# EAGLE schematic Lattepanda_shild_v1.2 (EAGLE 6.5.0)
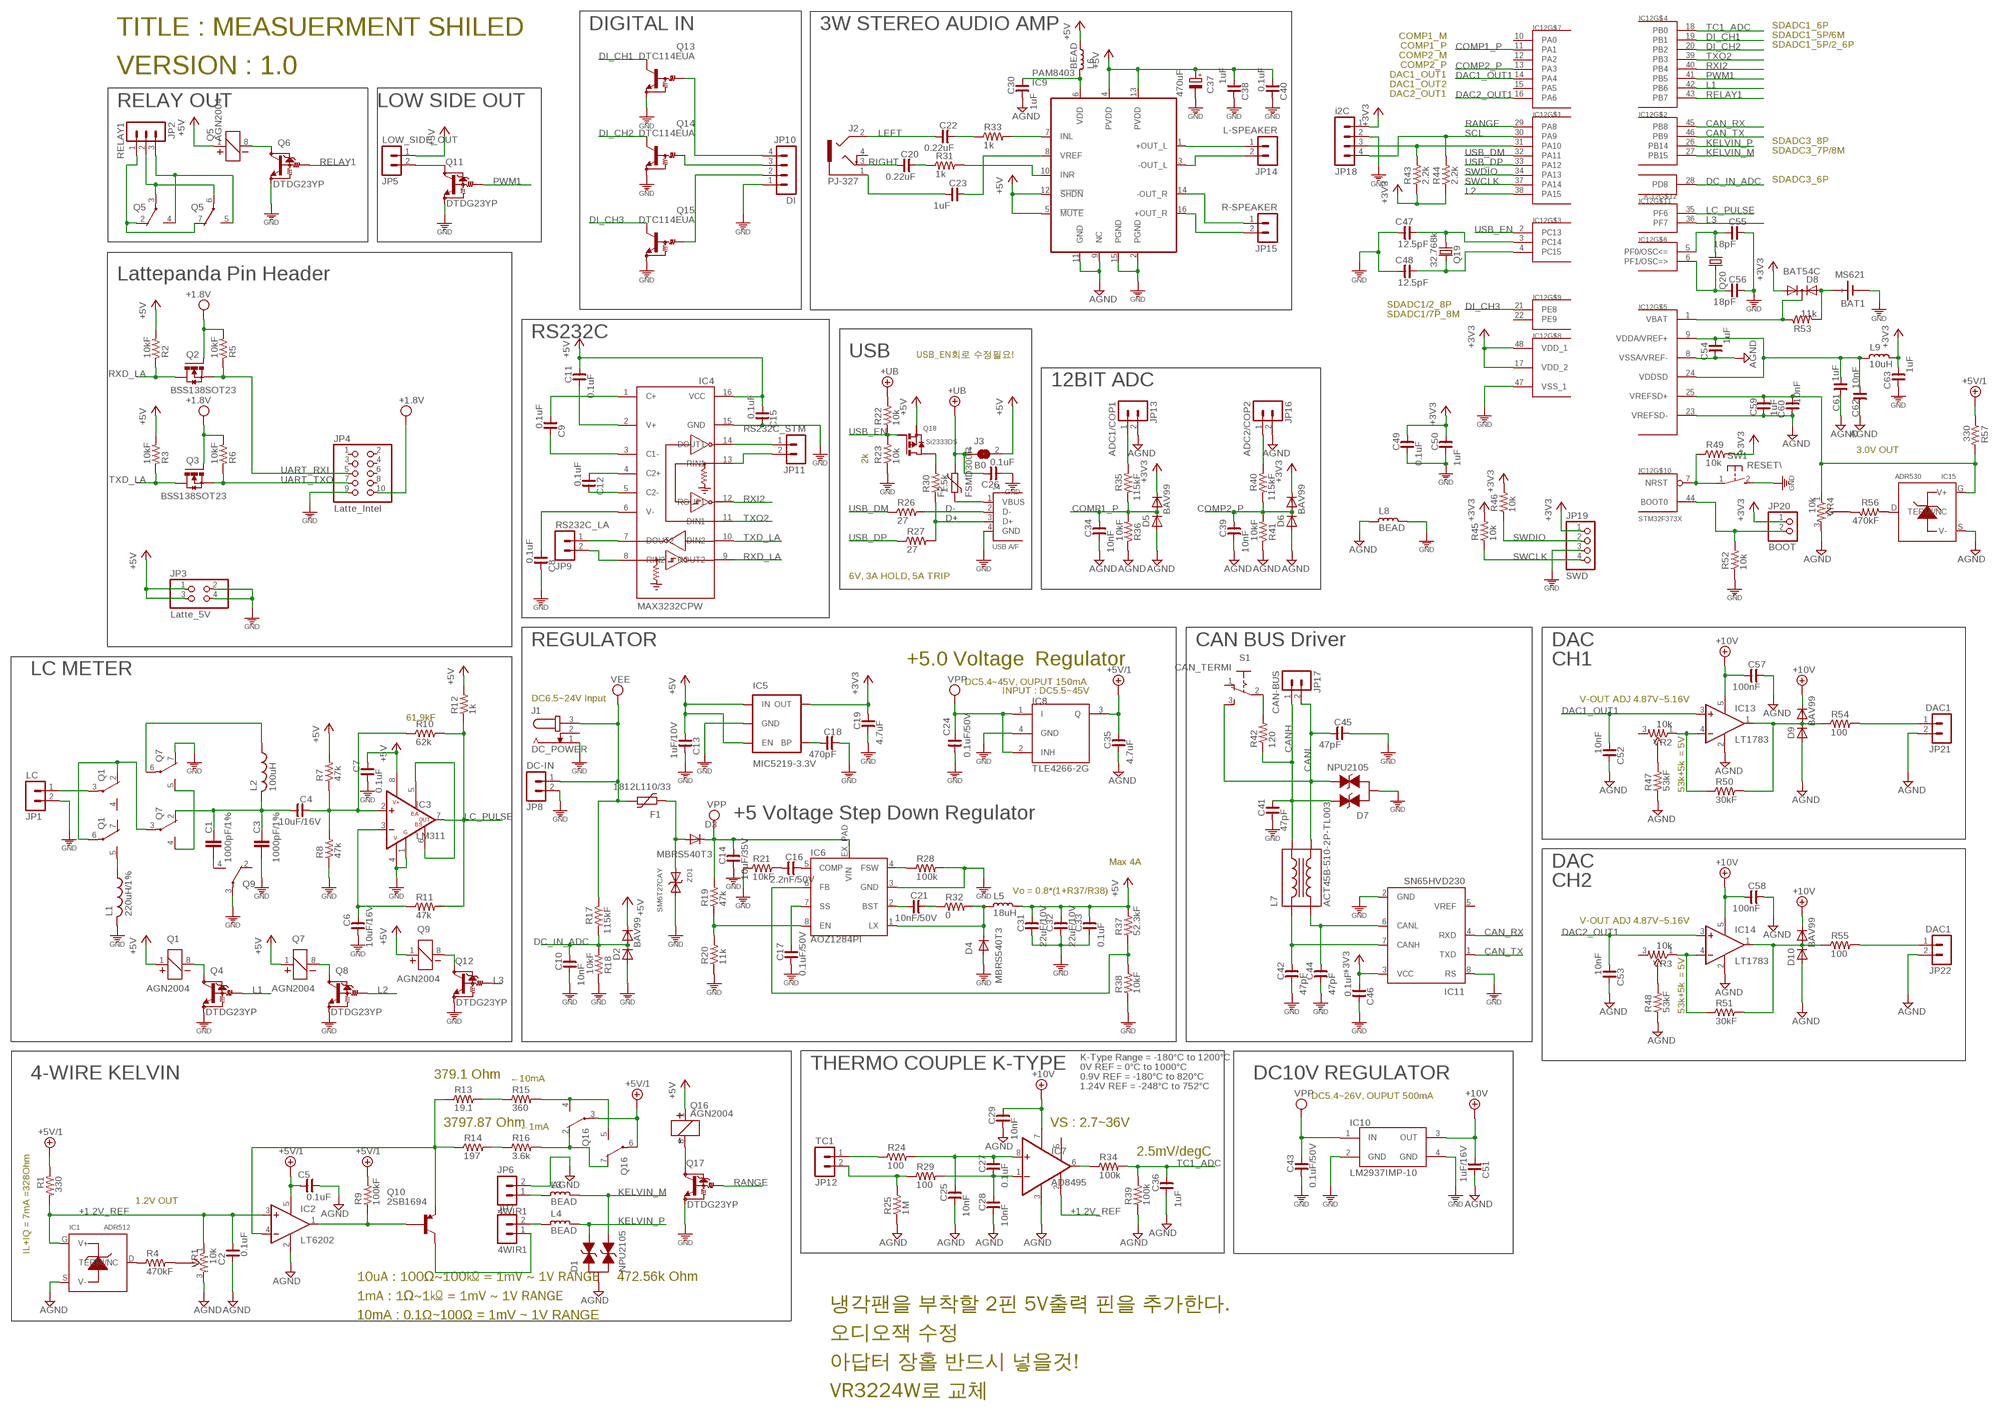
[diagram p0: schematic, sheet 1]

## Parts
BAT1  MS621  MS614  [MS621]
C1  1000pF/1%  C-EU050-025X075  [C050-025X075]
C2  0.1uF  C_0603  [C0603]
C3  1000pF/1%  C-EU050-025X075  [C050-025X075]
C4  10uF/16V  C_3216  [C3216]
C5  0.1uF  C_0603  [C0603]
C6  10uF/16V  C_3216  [C3216]
C7  0.1uF  C_0603  [C0603]
C8  0.1uF  C_0603  [C0603]
C9  0.1uF  C_0603  [C0603]
C10  10nF  C_0603  [C0603]
C11  0.1uF  C_0603  [C0603]
C12  0.1uF  C_0603  [C0603]
C13  1uF/10V  C_0603  [C0603]
C14  10uF/35V  C_3225  [C3225]
C15  0.1uF  C_0603  [C0603]
C16  2.2nF/50V  C_0603  [C0603]
C17  0.1uF/50V  C_0603  [C0603]
C18  470pF  C_0603  [C0603]
C19  4.7uF  C_2012  [C2012]
C20  0.22uF  C_0603  [C0603]
C21  10nF/50V  C_0603  [C0603]
C22  0.22uF  C_0603  [C0603]
C23  1uF  C_0603  [C0603]
C24  0.1uF/50V  C_0603  [C1608-]
C25  10nF  C_0603  [C0603]
C26  0.1uF  C_0603  [C0603]
C27  0.1uF  C_0603  [C0603]
C28  10nF  C_0603  [C0603]
C29  10nF  C_0603  [C0603]
C30  1uF  C_0603  [C0603]
C31  22uF/10V  C_3216  [C3216]
C32  22uF/10V  C_3216  [C3216]
C33  0.1uF  C_0603  [C0603]
C34  10nF  C_0603  [C0603]
C35  4.7uF  C_2012  [C2012]
C36  1uF  C_0603  [C0603]
C37  470uF  CPOL-EUD/7343-31W  [D/7343-31W]
C38  1uF  C_0603  [C0603]
C39  10nF  C_0603  [C0603]
C40  0.1uF  C_0603  [C0603]
C41  47pF  C_0603  [C0603]
C42  47pF  C_0603  [C0603]
C43  0.1uF/50V  C_0603  [C0603]
C44  47pF  C_0603  [C0603]
C45  47pF  C_0603  [C0603]
C46  0.1uF  C_0603  [C0603]
C47  12.5pF  C_0603  [C0603]
C48  12.5pF  C_0603  [C0603]
C49  0.1uF  C_0603  [C0603]
C50  1uF  C_0603  [C0603]
C51  1uF/16V  C_0603  [C0603]
C52  10nF  C_0603  [C0603]
C53  10nF  C_0603  [C0603]
C54  1uF  C_0603  [C0603]
C55  18pF  C_0603  [C0603]
C56  18pF  C_0603  [C0603]
C57  100nF  C_0603  [C0603]
C58  100nF  C_0603  [C0603]
C59  1uF  C_0603  [C0603]
C60  10nF  C_0603  [C0603]
C61  1uF  C_0603  [C0603]
C62  10nF  C_0603  [C0603]
C63  1uF  C_0603  [C0603]
D1  NPU2105  [SOT23]
D2  BAV99  [SOT23]
D3  MBRS540T3  DIODE-SMC  [SMC]
D4  MBRS540T3  DIODE-SMC  [SMC]
D5  BAV99  [SOT23]
D6  BAV99  [SOT23]
D7  NPU2105  [SOT23]
D8  BAT54C  [SOT23]
D9  BAV99  [SOT23]
D10  BAV99  [SOT23]
F1  1812L110/33  1812L  [1812L]
F2  FSMD300R  1812L  [1812L]
IC1  ADR512  ADR510  [SOT23]
IC2  LT6202  TS507S  [SOT23-5L]
IC3  LM311  [SO8]
IC4  MAX3232CPW  MAX3232MAX232CPW  [PW_R-PDSO-G16]
IC5  MIC5219-3.3V  V_REG_LDOSMD  [SOT23-5]
IC6  AOZ1284PI  [S08-EP1]
IC7  AD8495  AD849X  [MSOP8]
IC8  TLE4266-2G  TLE4266G  [SOT223-4]
IC9  PAM8403  [SOIC16N]
IC10  LM2937IMP-10  LM2937  [SOT223]
IC11  SN65HVD230  PCA82C250T  [SO8]
IC12  STM32F373X  [TQFP48]
IC13  LT1783  LT1783M5  [SOT23-5]
IC14  LT1783  LT1783M5  [SOT23-5]
IC15  ADR530  ADR510  [SOT23]
J1  DC_POWER  JACK-PLUG0  [SPC4077]
J2  PJ-327  AUDIO_JACK2  [PJ-327-2]
J3  B0  SJ  [SJ]
J4  USB A/F  USB-AUSBA_SIDE  [USB_AF_SIDE]
JP1  LC  MA02ED350V-02P  [ED350V-02P]
JP2  RELAY1  MA03-1ESD350V-03P  [ED350V-03P]
JP3  Latte_5V  PINHD-2X2  [2X02]
JP4  Latte_Intel  PINHD-2X5M  [2X05M]
JP5  LOW_SIDE_OUT  MA02ED350V-02P  [ED350V-02P]
JP6  4WIR1  MA02ED350V-02P  [ED350V-02P]
JP7  4WIR1  MA02ED350V-02P  [ED350V-02P]
JP8  DC-IN  MA02ED350V-02P  [ED350V-02P]
JP9  RS232C_LA  MA02ED350V-02P  [ED350V-02P]
JP10  DI  MA04-153047  [53047-04]
JP11  RS232C_STM  MA02ED350V-02P  [ED350V-02P]
JP12  TC1  MA02ED350V-02P  [ED350V-02P]
JP13  ADC1/COP1  MA02ED350V-02P  [ED350V-02P]
JP14  L-SPEAKER  MA02ED350V-02P  [ED350V-02P]
JP15  R-SPEAKER  MA02ED350V-02P  [ED350V-02P]
JP16  ADC2/COP2  MA02ED350V-02P  [ED350V-02P]
JP17  CAN-BUS  MA02ED350V-02P  [ED350V-02P]
JP18  i2C  MA04-15267  [MOLEX5267-04]
JP19  SWD  PINHD-1X4M  [1X04M]
JP20  BOOT  PINHD-1X2M  [1X02M]
JP21  DAC1  MA02ED350V-02P  [ED350V-02P]
JP22  DAC1  MA02ED350V-02P  [ED350V-02P]
L1  220uH/1%  L-US0207/2V  [0207/2V]
L2  100uH  L-US0207/2V  [0207/2V]
L3  BEAD  L_0603  [L0603]
L4  BEAD  L_0603  [L0603]
L5  18uH  L_SHP1260P-F  [SHP1260P-F]
L6  BEAD  L_0805  [L0805]
L7  ACT45B-510-2P-TL003  CHOKE_COIL  [ACT45B]
L8  BEAD  L_0603  [L0603]
L9  10uH  L_0805  [L0805]
Q1  AGN2004  RELAY_CH2AGN200X  [ANG200X]
Q2  BSS138SOT23  [SOT23]
Q3  BSS138SOT23  [SOT23]
Q4  DTDG23YP  [MPT3]
Q5  AGN2004  RELAY_CH2AGN200X  [ANG200X]
Q6  DTDG23YP  [MPT3]
Q7  AGN2004  RELAY_CH2AGN200X  [ANG200X]
Q8  DTDG23YP  [MPT3]
Q9  AGN2004  RELAY_CH2AGN200X  [ANG200X]
Q10  2SB1694  [SOT323]
Q11  DTDG23YP  [MPT3]
Q12  DTDG23YP  [MPT3]
Q13  DTC114EUA  [SC59-BEC]
Q14  DTC114EUA  [SC59-BEC]
Q15  DTC114EUA  [SC59-BEC]
Q16  AGN2004  RELAY_CH2AGN200X  [ANG200X]
Q17  DTDG23YP  [MPT3]
Q18  Si2333DS  P-FET  [SOT23]
Q19  32.768k  MC-306  [MC-306]
Q20  8MHz  CRYSTALSMD5032  [SMD5032]
R1  330  R_0603  [R0603]
R2  10kF  R_0603  [R0603]
R3  10kF  R_0603  [R0603]
R4  470kF  R_0603  [R0603]
R5  10kF  R_0603  [R0603]
R6  10kF  R_0603  [R0603]
R7  47k  R_0603  [R0603]
R8  47k  R_0603  [R0603]
R9  100kF  R_0603  [R0603]
R10  62k  R_0603  [R0603]
R11  47k  R_0603  [R0603]
R12  1k  R_0603  [R0603]
R13  19.1  R_0603  [R0603]
R14  197  R_0603  [R0603]
R15  360  R_0603  [R0603]
R16  3.6k  R_0603  [R0603]
R17  115kF  R_0603  [R0603]
R18  10kF  R_0603  [R0603]
R19  47k  R_0603  [R0603]
R20  11k  R_0603  [R0603]
R21  10kF  R_0603  [R0603]
R22  10k  R_0603  [R0603]
R23  10k  R_0603  [R0603]
R24  100  R_0603  [R0603]
R25  1M  R_0603  [R0603]
R26  27  R_0603  [R0603]
R27  27  R_0603  [R0603]
R28  100k  R_0603  [R0603]
R29  100  R_0603  [R0603]
R30  1.5k  R_0603  [R0603]
R31  1k  R_0603  [R0603]
R32  0  R_0603  [R0603]
R33  1k  R_0603  [R0603]
R34  100k  R_0603  [R0603]
R35  115kF  R_0603  [R0603]
R36  10kF  R_0603  [R0603]
R37  52.3kF  R_0603  [R0603]
R38  10kF  R_0603  [R0603]
R39  100k  R_0603  [R0603]
R40  115kF  R_0603  [R0603]
R41  10kF  R_0603  [R0603]
R42  120  R-US_R1608  [R0603@1]
R43  2.2k  R_0603  [R0603]
R44  2.2k  R_0603  [R0603]
R45  10k  R_0603  [R0603]
R46  10k  R_0603  [R0603]
R47  53kF  R_0603  [R0603]
R48  53kF  R_0603  [R0603]
R49  10k  R_0603  [R0603]
R50  30kF  R_0603  [R0603]
R51  30kF  R_0603  [R0603]
R52  10k  R_0603  [R0603]
R53  11k  R_0603  [R0603]
R54  100  R_0603  [R0603]
R55  100  R_0603  [R0603]
R56  470kF  R_0603  [R0603]
R57  330  R_0603  [R0603]
S1  CAN_TERMI  IMMS  [255SB]
SW1  RESET\  DTSM-3  [DTSM-3]
VR1  10k  R-TRIMMER-SMDBOUNS  [3266W]
VR2  10k  R-TRIMMER-SMD3313  [R-TRIMMER-3313J]
VR3  10k  R-TRIMMER-SMD3313  [R-TRIMMER-3313J]
VR4  10k  R-TRIMMER-SMDBOUNS  [3266W]
ZD1  SM6T27CAY  ZDSM6T33CAY  [SMB]

## Nets
+1.2V_REF: C2.2 IC1.G(V+) IC2.3(+IN) IC7.2(REF) R1.2 VR1.1
+3V3: C19.1 C46.2 C49.1 C50.1 C63.2 D5.S(C) D6.S(C) D8.G IC5.5(OUT) IC11.3(VCC) IC12.17(VDD_2) IC12.48(VDD_1) JP18.1 JP19.1 JP20.1 L9.1 R43.1 R44.1 R45.2 R46.2 R49.2
+5V: C7.1 C11.1 C13.2 C15.2 C31.1 C32.1 C33.1 C37.+ C38.2 C40.2 D2.S(C) IC3.8(V+) IC4.16(VCC) IC5.1(IN) IC5.3(EN) IC9.4(PVDD) IC9.5(!MUTE) IC9.12(!SHDN) IC9.13(PVDD) J3.2 JP3.1 JP3.3 JP5.1 L5.1 L6.1 Q1.1 Q5.1 Q7.1 Q9.1 Q16.1 Q18.S(SOURCE) R2.2 R3.2 R7.2 R12.2 R37.2
+5V/1: C5.1 C35.1 IC2.5(V+) IC8.3(Q) Q16.3(P) Q16.6(P) R1.1 R9.2 R57.1
+10V: C29.1 C51.2 C57.2 C58.2 D9.S(C) D10.S(C) IC7.7(V+) IC10.3(OUT) IC13.5(V+) IC14.5(V+)
+UB: C26.1 F2.P$2 J3.1 R22.2
AGND: C2.1 C5.2 C25.2 C28.2 C29.2 C30.2 C34.2 C35.2 C36.2 C39.2 C51.1 C52.1 C53.1 C54.1 C57.1 C58.1 C59.2 C60.1 C61.1 C62.1 D1.D(PIN3) D5.G(A) D6.G(A) D9.G(A) D10.G(A) IC1.S(V-) IC2.2(V-) IC7.3(V-) IC9.9(NC) IC9.11(GND) IC12.8(VSSA/VREF-) IC12.23(VREFSD-) IC13.2(V-) IC14.2(V-) IC15.S(V-) JP6.2 JP13.2 JP16.2 JP21.2 JP22.2 L8.2 R25.1 R36.1 R39.1 R41.1 R47.1 R48.1 VR1.3 VR4.3
BOOT1: IC12.44(BOOT0) JP20.2 R52.2
CAN_RX: IC11.4(RXD) IC12.45(PB8)
CAN_TX: IC11.1(TXD) IC12.46(PB9)
CANH: C41.1 D7.G(PIN1) JP17.1 L7.4 R42.1
CANL: C45.2 D7.S(PIN2) JP17.2 L7.3 S1.3(S)
COMP1_P: C34.1 D5.D(AC) IC12.11(PA1) R35.2 R36.2
COMP2_P: C39.1 D6.D(AC) IC12.13(PA3) R40.2 R41.2
D+: J4.3(D+) R27.2 R30.1
D-: J4.2(D-) R26.2
DAC1_OUT1: C52.2 IC12.14(PA4) IC13.3(+IN)
DAC2_OUT1: C53.2 IC12.16(PA6) IC14.3(+IN)
DC-IN: D3.A F1.P$1 ZD1.A
DC_IN_ADC: C10.1 D2.D(AC) IC12.28(PD8) R17.2 R18.2
DI_CH1: IC12.19(PB1) Q13.3(OUT)
DI_CH2: IC12.20(PB2) Q14.3(OUT)
DI_CH3: IC12.21(PE8) Q15.3(OUT)
GND [GND]: BAT1.- C3.2 C6.2 C7.2 C8.1 C10.2 C13.1 C14.2 C15.1 C17.2 C18.1 C19.2 C24.1 C26.2 C31.2 C32.2 C33.2 C37.- C38.1 C40.1 C41.2 C42.2 C43.2 C44.2 C45.1 C46.1 C47.1 C48.1 C49.2 C50.2 C55.1 C56.1 C63.1 D2.G(A) D4.A D7.D(PIN3) IC3.1(G) IC3.4(V-) IC4.15(GND) IC5.2(GND) IC6.3(GND) IC8.4(GND) IC9.2(PGND) IC9.15(PGND) IC10.2(GND) IC10.4(GND) IC11.2(GND) IC11.8(RS) IC12.47(VSS_1) J1.1 J4.4(GND) JP1.2 JP3.2 JP3.4 JP4.9 JP8.2 JP10.1 JP18.2 JP19.3 L1.2 L8.1 Q4.EMITTER(GND) Q6.EMITTER(GND) Q7.7(O) Q8.EMITTER(GND) Q9.3(P) Q11.EMITTER(GND) Q12.EMITTER(GND) Q13.1(GND) Q14.1(GND) Q15.1(GND) Q17.EMITTER(GND) R8.1 R18.1 R20.1 R21.1 R23.1 R28.2 R38.1 R52.1 SW1.2 ZD1.C(K)
KELVIN_M: D1.S(PIN2) IC12.27(PB15) L3.1
KELVIN_P: D1.G(PIN1) IC12.26(PB14) L4.1
L1: IC12.42(PB6) Q4.BASE(IN)
L2: IC12.38(PA15) Q8.BASE(IN)
L3: IC12.36(PF7) Q12.BASE(IN)
LC_PULSE: IC3.7(OUT) IC12.35(PF6) R10.2 R11.2 R12.1
LEFT: C22.2 J2.2
N$1 [GND]: JP5.2 Q11.COLLECTOR(OUT)
N$2: IC15.D(TERMI/NC) R56.1
N$3: IC6.6(FB) R37.1 R38.2
N$4: C21.2 IC6.2(BST)
N$5: C44.1 IC11.6(CANL) L7.2
N$6: C42.1 IC11.7(CANH) L7.1
N$7: R14.2 R16.1
N$8: C21.1 R32.1
N$9: D4.C IC6.1(LX) L5.2 R32.2
N$10: C16.1 IC6.5(COMP)
N$11: C16.2 R21.2
N$12: R42.2 S1.2(P)
N$13: R48.2 VR3.2
N$14: C12.1 IC4.5(C2-)
N$15: C12.2 IC4.4(C2+)
N$16: C11.2 IC4.2(V+)
N$17: IC14.4(-IN) R51.1 VR3.1
N$18: D10.D(AC) IC14.1(OUT) R51.2 R55.1
N$19: IC6.8(EN) R19.1 R20.2
N$20: JP6.1 L3.2
N$21: IC6.4(FSW) R28.1
N$22: JP7.2 L4.2
N$24: C17.1 IC6.7(SS)
N$25: D8.D IC12.1(VBAT) R53.1
N$26: C8.2 IC4.6(V-)
N$27: C9.2 IC4.1(C+)
N$28: IC4.8(RIN2) JP9.2
N$29: C9.1 IC4.3(C1-)
N$30: IC2.1(OUT) Q10.2(B) R9.1
N$31: Q5.8 Q6.COLLECTOR(OUT)
N$32: IC4.7(DOUT2) JP9.1
N$33: R56.2 VR4.2
N$34: IC12.7(NRST) R49.1 SW1.1
N$35: C56.2 IC12.6(PF1/OSC=>) Q20.3
N$36: IC4.13(RIN1) JP11.2
N$37: IC3.5(BA) IC3.6(BS)
N$38: C54.2 C61.2 C62.2 IC12.9(VDDA/VREF+) IC12.24(VDDSD) L9.2
N$39: C6.1 IC3.3(-IN) R11.1
N$40: IC4.14(DOUT1) JP11.1
N$41: C27.2 C28.1 IC7.1(-IN) R29.2
N$42: C25.1 C27.1 IC7.8(+IN) R24.2
N$43: IC9.7(INL) R33.2
N$44: IC9.1(+OUT_L) JP14.1
N$45: JP12.2 R25.2 R29.1
N$46: JP12.1 R24.1
N$47: IC7.6(OUT) R34.1
N$48: C4.1 IC3.2(+IN) R7.1 R8.2 R10.1
N$49: JP7.1 Q10.3(C)
N$50: JP13.1 R35.1
N$51: JP16.1 R40.1
N$52: IC9.3(-OUT_L) JP14.2
N$53: IC9.14(-OUT_R) JP15.1
N$54: IC9.16(+OUT_R) JP15.2
N$55: IC9.10(INR) R31.2
N$56: C23.1 IC9.8(VREF)
N$57: C23.2 J2.1
N$58: C22.1 R33.1
N$59: F2.P$1 J4.1(VBUS)
N$60: JP21.1 R54.2
N$61: IC1.D(TERMI/NC) R4.1
N$62: C18.2 IC5.4(BP)
N$63: R4.2 VR1.2
N$64: R13.2 R15.1
N$65: C20.1 R31.1
N$66: Q16.8 Q17.COLLECTOR(OUT)
N$67: Q16.4(S) Q16.5(S) R15.2
N$68: C59.1 C60.2 IC12.25(VREFSD+) IC15.G(V+) R57.2 VR4.1
N$69: C30.1 IC9.6(VDD) L6.2
N$70: IC2.4(-IN) Q10.1(E) R13.1 R14.1
N$71: IC13.4(-IN) R50.1 VR2.1
N$72: Q16.2(O) Q16.7(O) R16.2
N$73: Q7.4(S) Q7.5(S)
N$74: C1.1 C3.1 C4.2 L2.2 Q7.2(O)
N$75: Q9.8 Q12.COLLECTOR(OUT)
N$76: Q7.8 Q8.COLLECTOR(OUT)
N$77: Q1.2(O) Q1.6(P) Q7.3(P)
N$78: C1.2 Q9.4(S)
N$79: L2.1 Q7.6(P)
N$80: Q1.8 Q4.COLLECTOR(OUT)
N$81: Q18.D(DRAIN) R30.2
N$82: L1.1 Q1.5(S)
N$83: JP1.1 Q1.3(P)
N$84: D9.D(AC) IC13.1(OUT) R50.2 R54.1
N$85: R47.2 VR2.2
N$86: JP2.2 Q5.3(P) Q5.6(P)
N$87: C55.2 IC12.5(PF0/OSC<=) Q20.1
N$88: JP2.1 Q5.2(O) Q5.7(O)
N$89: JP2.3 Q5.4(S) Q5.5(S)
N$90: JP22.1 R55.2
N$91: IC12.31(PA10) JP18.3 R43.2
N$92: BAT1.+ D8.S R53.2
N$93: JP10.2 Q15.2(IN)
N$94: JP10.3 Q14.2(IN)
N$95: C47.2 IC12.3(PC14) Q19.1
N$96: C48.2 IC12.4(PC15) Q19.4
N$97: JP10.4 Q13.2(IN)
PWM1: IC12.41(PB5) Q11.BASE(IN)
RANGE: IC12.29(PA8) Q17.BASE(IN)
RELAY1: IC12.43(PB7) Q6.BASE(IN)
RIGHT: C20.2 J2.3
RXD_LA: IC4.9(ROUT2) Q2.D R2.1
RXI2: IC4.12(ROUT1) IC12.40(PB4)
SCL: IC12.30(PA9) JP18.4 R44.2
SWCLK: IC12.37(PA14) JP19.4 R45.1
SWDIO: IC12.34(PA13) JP19.2 R46.1
TC1_ADC: C36.1 IC12.18(PB0) R34.2 R39.2
TXD_LA: IC4.10(DIN2) Q3.D R3.1
TXO2: IC4.11(DIN1) IC12.39(PB3)
UART_RXI: JP4.5 Q2.S R5.1
UART_TXO: JP4.7 Q3.S R6.1
USB_DM: IC12.32(PA11) R26.1
USB_DP: IC12.33(PA12) R27.1
USB_EN: IC12.2(PC13) Q18.G(GATE) R22.1 R23.2
VDD: JP4.10 Q2.G Q3.G R5.2 R6.2 ; supply symbol labelled +1.8V
VEE: F1.P$2 J1.3 JP8.1 R17.1
VPP: C14.1 C24.2 C43.1 D3.C IC6.EX_PAD(VIN) IC8.1(I) IC8.2(INH) IC10.1(IN) R19.2
Unconnected: IC7.5(SENS) IC11.5(VREF) IC12.10(PA0) IC12.12(PA2) IC12.15(PA5) IC12.22(PE9) J1.2 J2.4 JP4.1 JP4.2 JP4.3 JP4.4 JP4.6 JP4.8 Q1.4(S) Q1.7(O) Q9.2(O) Q9.5(S) Q9.6(P) Q9.7(O) S1.1(O) VR2.3 VR3.3

## Notes on the sheet
- SDADC1_6P
- TITLE : MEASUERMENT SHILED | DIGITAL IN | 3W STEREO AUDIO AMP | SDADC1_5P/6M
- COMP1_M | SDADC1_5P/2_6P
- COMP1_P
- COMP2_M
- COMP2_P
- VERSION : 1.0
- DAC1_OUT1
- DAC1_OUT2
- DAC2_OUT1
- RELAY OUT | LOW SIDE OUT
- SDADC3_8P
- SDADC3_7P/8M
- SDADC3_6P
- Lattepanda Pin Header
- SDADC1/2_8P
- SDADC1/7P_8M
- RS232C
- USB | USB_EN회로 수정필요!
- 12BIT ADC
- 3.0V OUT
- 2k
- 6V, 3A HOLD, 5A TRIP
- REGULATOR | CAN BUS Driver | DAC
- +5.0 Voltage  Regulator | CH1
- LC METER
- DC5.4~45V, OUPUT 150mA
- DC6.5~24V Input | INPUT : DC5.5~45V | V-OUT ADJ 4.87V~5.16V
- 61.9kF
- 53k+5k  = 5V
- +5 Voltage Step Down Regulator
- Max 4A
- DAC
- Vo = 0.8*(1+R37/R38) | CH2
- V-OUT ADJ 4.87V~5.16V
- 53k+5k  = 5V
- K-Type Range = -180°C to 1200°C
- THERMO COUPLE K-TYPE | 0V REF = 0°C to 1000°C
- 4-WIRE KELVIN | 379.1 Ohm | 0.9V REF = -180°C to 820°C | DC10V REGULATOR
- ←10mA
- 1.24V REF = -248°C to 752°C
- DC5.4~26V, OUPUT 500mA
- 3797.87 Ohm | VS : 2.7~36V
- ←1mA
- 2.5mV/degC
- 1.2V OUT
- IL+IQ = 7mA =328Ohm
- 10uA : 100Ω~100㏀ = 1mV ~ 1V RANGE | 472.56k Ohm
- 1mA : 1Ω~1㏀ = 1mV ~ 1V RANGE
- 냉각팬을 부착할 2핀 5V출력 핀을 추가한다.
- 10mA : 0.1Ω~100Ω = 1mV ~ 1V RANGE
- 오디오잭 수정
- 아답터 장홀 반드시 넣을것!
- VR3224W로 교체

## Library data of the parts
BAT1 = cona_lib:MS614: SII Micro Battery
C1 C3 = rcl:C-EU: CAPACITOR, European symbol
C2 C4-C23 C25-C36 C38-C63 = cona_lib:C_: NON-POLARIZED CAP
C24 = GRU-EURO6:C_: NON-POLARIZED CAP
C37 = cona_lib:CPOL-EU: POLARIZED CAPACITOR, European symbol
D1 D7 = cona_lib:NPU2105
D2 D5 D6 D9 D10 = cona_lib:BAV99
D3 D4 = diode:DIODE-: DIODE
D8 = cona_lib:BAT54C
F1 F2 = ptc-littlefuse:1812L
IC1 IC15 = cona_lib:ADR510
IC2 = cona_lib:TS507: High precision rail-to-rail operational amplifier Ultra low offset voltage: 25 µV typ, 100 µV max
IC3 = cona_lib:LM311
IC4 = cona_lib:MAX3232: TI
IC5 = SparkFun:V_REG_LDO: Voltage Regulator LDO Standard 150mA LDO voltage regulator in SOT-23 layout. Micrel part MIC5205. BP (by-pass) pin is used to lower output noise with 470pF cap.
IC6 = cona_lib:AOZ1284PI
IC7 = cona_lib:AD849X
IC8 = GRU-EURO6:TLE4266G
IC9 = cona_lib:PAM8403
IC10 = cona_lib:LM2937
IC11 = cona_lib:PCA82C250: CAN CONTROLLER INTERFACE
IC12 = stm32:STM32F373X
IC13 IC14 = GRU-EURO6:LT1783: General Purpose, Low Voltage, Rail-to-Rail Output Operational Amplifiers Source: http://www.national.com/mpf/LM/LMV321.html http://www.national.com/dt/lmv_qual.pdf
J1 = con-jack:JACK-PLUG: DC POWER JACK Power Jack, DC, Right Angle, Through Hole, Rated 5A at 16VDC, PC Terminals Distributor: Farnell (www.Farnell.de) Drawing: 84N1161.pdf / 84N1162.pdf Manufacturer: SPC Technology (www.spctechnology.com) Type: SPC4077 / SPC 4078
J2 = cona_lib:AUDIO_JACK2
J3 = cona_lib:SJ: SMD solder JUMPER
J4 = cona_lib:USB-A: USB A NTOM20014
JP1 JP5-JP9 JP11-JP17 JP21 JP22 = cona_lib:MA02
JP2 = cona_lib:MA03-1: PIN HEADER
JP3 = pinhead:PINHD-2X2: PIN HEADER
JP4 = pinhead:PINHD-2X5: PIN HEADER
JP10 JP18 = cona_lib:MA04-1: PIN HEADER
JP19 = pinhead:PINHD-1X4: PIN HEADER
JP20 = pinhead:PINHD-1X2: PIN HEADER
L1 L2 = rcl:L-US: INDUCTOR, American symbol
L3-L6 L8 L9 = cona_lib:L_: INDUCTOR
L7 = cona_lib:CHOKE_COIL
Q1 Q5 Q7 Q9 Q16 = cona_lib:RELAY_CH2
Q2 Q3 = cona_lib:BSS138: N-Channel Logic Level Enhancement Mode Field Effect Transistor
Q4 Q6 Q8 Q11 Q12 Q17 = cona_lib:DTDG23YP
Q10 = cona_lib:2SB1694
Q13-Q15 = cona_lib:DTC114EUA: NPN Bias Resistor Transistor
Q18 = cona_lib:P-FET
Q19 = crystal:MC-306: kHz RANGE CRYSTAL UNIT SMD Source: MC-306_405_406_E07X.PDF Homepage <http://www.epsontoyocom.co.jp>; MPN: MC-306 60.0KHZ 100PPM ,12.5PF; OC_FARNELL: 1278040; OC_NEWARK: 31M5576
Q20 = cona_lib:CRYSTAL: CRYSTAL
R1-R41 R43-R57 = cona_lib:R_: RESISTOR
R42 = cona_lib:R-US_: RESISTOR, American symbol
S1 = cona_lib:IMMS: SLIDING SWITCH Distributor Buerklin, 11G810
SW1 = switch-tact:DTSM-3
VR1-VR4 = cona_lib:R-TRIMMER-SMD: SMD R-TRIMMER
ZD1 = GRU-EURO6:ZD

## Net classes
0 default: clearance 0.2 mm
1 power: width 0.152 mm
2 GND: width 0.152 mm, clearance 0.152 mm